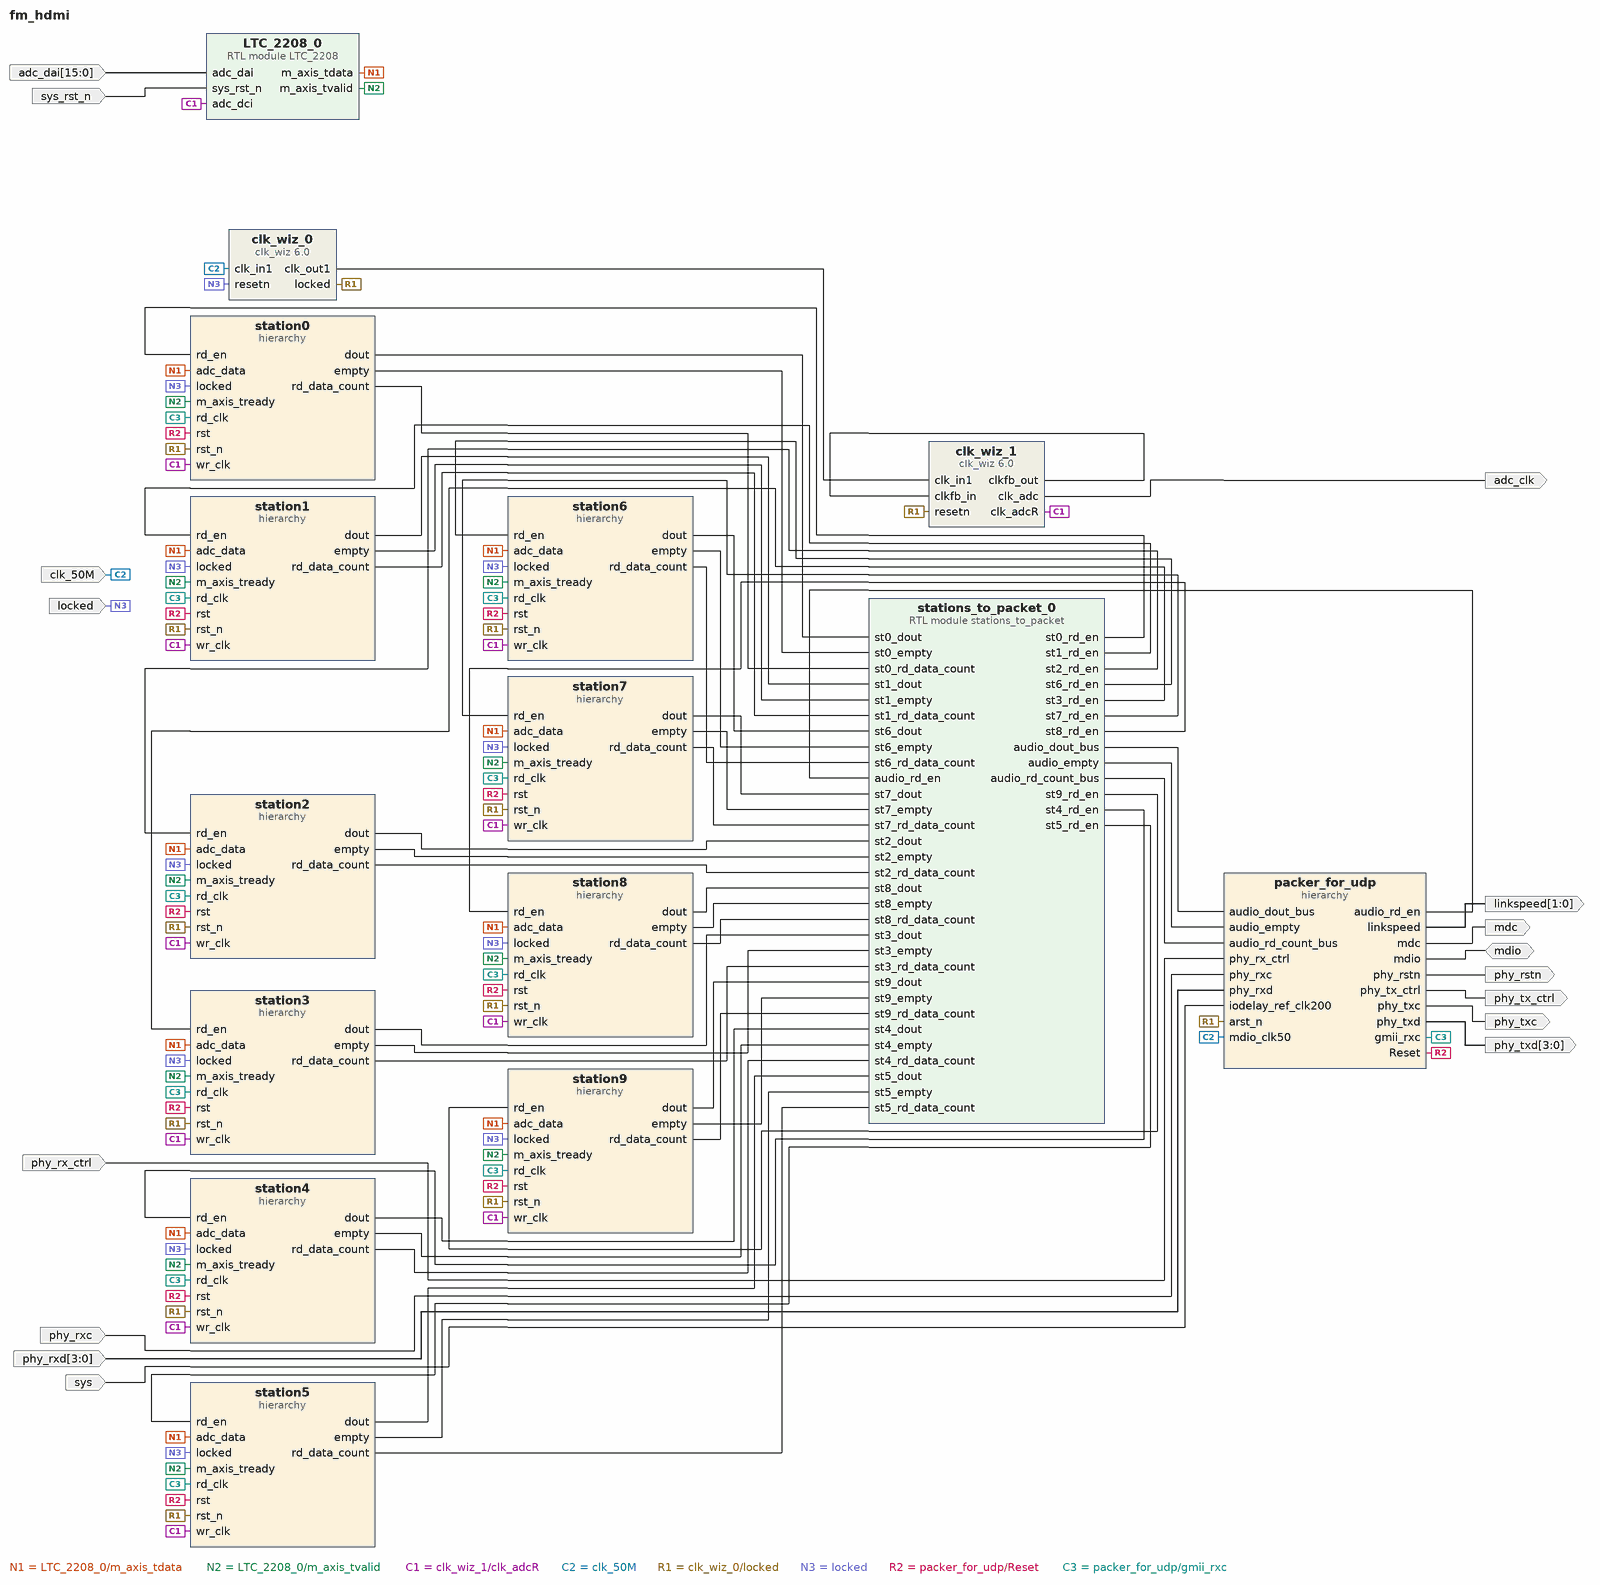
[diagram p0: block diagram of the top level]
# Vivado block design fm_hdmi, xc7z020clg400-2, Vivado 2023.2
create_bd_design fm_hdmi

create_bd_port -dir I -type rst sys_rst_n
create_bd_port -dir I -from 15 -to 0 adc_dai
create_bd_port -dir I locked
create_bd_port -dir I -type clk sys
set_property -dict {CONFIG.FREQ_HZ 200000000} [get_bd_ports sys]
create_bd_port -dir I -type clk clk_50M
set_property -dict {CONFIG.FREQ_HZ 50000000} [get_bd_ports clk_50M]
create_bd_port -dir O -type clk adc_clk
create_bd_port -dir I phy_rxc
create_bd_port -dir I phy_rx_ctrl
create_bd_port -dir I -from 3 -to 0 phy_rxd
create_bd_port -dir IO mdio
create_bd_port -dir O -from 3 -to 0 phy_txd
create_bd_port -dir O mdc
create_bd_port -dir O -type rst phy_rstn
create_bd_port -dir O phy_tx_ctrl
create_bd_port -dir O -from 1 -to 0 linkspeed
create_bd_port -dir O phy_txc

create_bd_cell -type ip -vlnv xilinx.com:ip:clk_wiz:6.0 clk_wiz_0
set_property -dict [list \
  CONFIG.CLKIN1_JITTER_PS 200.0 \
  CONFIG.CLKOUT1_DRIVES BUFG \
  CONFIG.CLKOUT1_JITTER 114.306 \
  CONFIG.CLKOUT1_PHASE_ERROR 120.359 \
  CONFIG.CLKOUT1_REQUESTED_OUT_FREQ 64 \
  CONFIG.CLKOUT2_DRIVES BUFG \
  CONFIG.CLKOUT3_DRIVES BUFG \
  CONFIG.CLKOUT4_DRIVES BUFG \
  CONFIG.CLKOUT5_DRIVES BUFG \
  CONFIG.CLKOUT6_DRIVES BUFG \
  CONFIG.CLKOUT7_DRIVES BUFG \
  CONFIG.MMCM_BANDWIDTH OPTIMIZED \
  CONFIG.MMCM_CLKFBOUT_MULT_F 32 \
  CONFIG.MMCM_CLKIN1_PERIOD 20.000 \
  CONFIG.MMCM_CLKIN2_PERIOD 10.0 \
  CONFIG.MMCM_CLKOUT0_DIVIDE_F 25 \
  CONFIG.MMCM_COMPENSATION ZHOLD \
  CONFIG.PRIMITIVE PLL \
  CONFIG.PRIM_IN_FREQ 50 \
  CONFIG.PRIM_SOURCE No_buffer \
  CONFIG.RESET_PORT resetn \
  CONFIG.RESET_TYPE ACTIVE_LOW \
] [get_bd_cells clk_wiz_0]
create_bd_cell -type ip -vlnv xilinx.com:ip:clk_wiz:6.0 clk_wiz_1
set_property -dict [list \
  CONFIG.CLKIN1_JITTER_PS 156.25 \
  CONFIG.CLKOUT1_DRIVES No_buffer \
  CONFIG.CLKOUT1_JITTER 107.365 \
  CONFIG.CLKOUT1_PHASE_ERROR 119.507 \
  CONFIG.CLKOUT1_REQUESTED_OUT_FREQ 76.8 \
  CONFIG.CLKOUT2_DRIVES BUFG \
  CONFIG.CLKOUT2_JITTER 107.365 \
  CONFIG.CLKOUT2_PHASE_ERROR 119.507 \
  CONFIG.CLKOUT2_REQUESTED_OUT_FREQ 76.8 \
  CONFIG.CLKOUT2_REQUESTED_PHASE 65 \
  CONFIG.CLKOUT2_USED true \
  CONFIG.CLKOUT3_DRIVES BUFG \
  CONFIG.CLKOUT4_DRIVES BUFG \
  CONFIG.CLKOUT5_DRIVES BUFG \
  CONFIG.CLKOUT6_DRIVES BUFG \
  CONFIG.CLKOUT7_DRIVES BUFG \
  CONFIG.CLK_OUT1_PORT clk_adc \
  CONFIG.CLK_OUT2_PORT clk_adcR \
  CONFIG.FEEDBACK_SOURCE FDBK_ONCHIP \
  CONFIG.JITTER_SEL Min_O_Jitter \
  CONFIG.MMCM_BANDWIDTH HIGH \
  CONFIG.MMCM_CLKFBOUT_MULT_F 24 \
  CONFIG.MMCM_CLKIN1_PERIOD 15.625 \
  CONFIG.MMCM_CLKIN2_PERIOD 10.0 \
  CONFIG.MMCM_CLKOUT0_DIVIDE_F 20 \
  CONFIG.MMCM_CLKOUT1_DIVIDE 20 \
  CONFIG.MMCM_CLKOUT1_PHASE 65.250 \
  CONFIG.MMCM_COMPENSATION ZHOLD \
  CONFIG.MMCM_DIVCLK_DIVIDE 1 \
  CONFIG.NUM_OUT_CLKS 2 \
  CONFIG.PLL_CLKIN_PERIOD 15.625 \
  CONFIG.PRIMITIVE PLL \
  CONFIG.PRIM_IN_FREQ 64 \
  CONFIG.PRIM_SOURCE No_buffer \
  CONFIG.RESET_PORT resetn \
  CONFIG.RESET_TYPE ACTIVE_LOW \
] [get_bd_cells clk_wiz_1]
create_bd_cell -type hier packer_for_udp
create_bd_cell -type module -reference LTC_2208 LTC_2208_0
create_bd_cell -type hier station0
create_bd_cell -type module -reference stations_to_packet stations_to_packet_0
set_property -dict {CONFIG.COUNT_W 7 CONFIG.STATIONS 10} [get_bd_cells stations_to_packet_0]
create_bd_cell -type hier station1
create_bd_cell -type hier station2
create_bd_cell -type hier station3
create_bd_cell -type hier station4
create_bd_cell -type hier station5
create_bd_cell -type hier station6
create_bd_cell -type hier station7
create_bd_cell -type hier station8
create_bd_cell -type hier station9

# ---- hierarchy /packer_for_udp ----
current_bd_instance /packer_for_udp
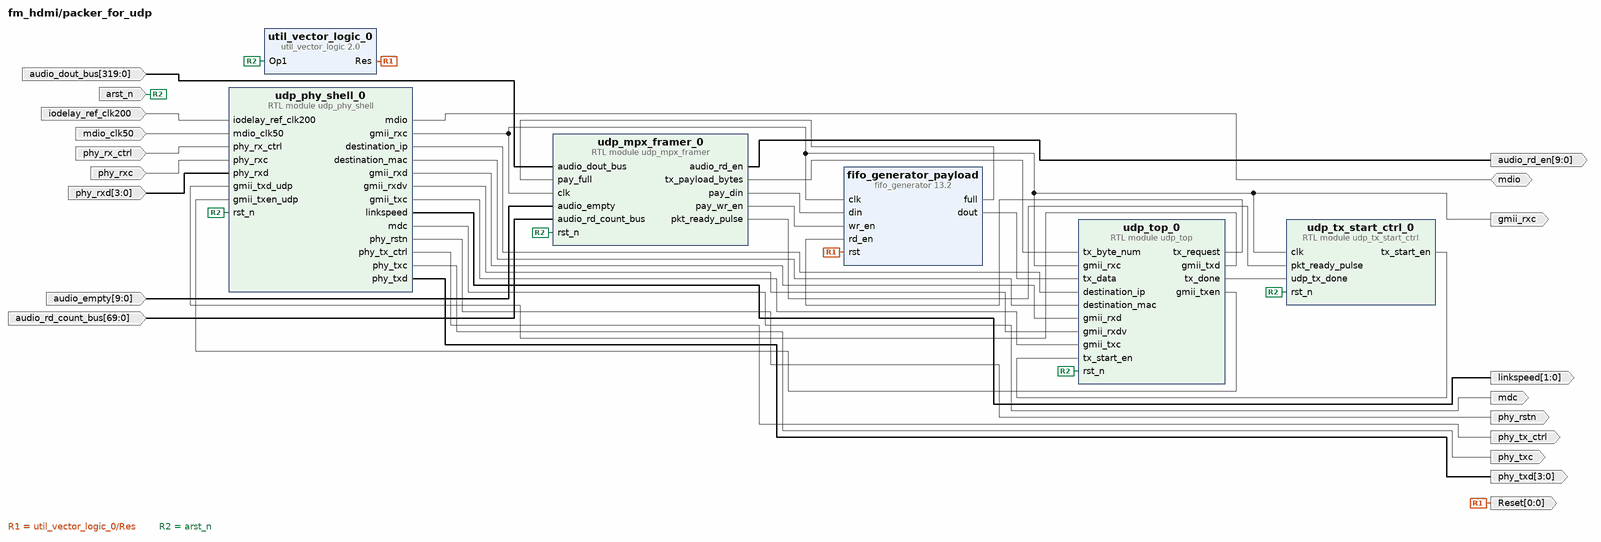
[diagram p1: block diagram inside /packer_for_udp]
create_bd_pin -dir I -type rst arst_n
create_bd_pin -dir I iodelay_ref_clk200
create_bd_pin -dir I mdio_clk50
create_bd_pin -dir I phy_rx_ctrl
create_bd_pin -dir I -from 3 -to 0 phy_rxd
create_bd_pin -dir I phy_rxc
create_bd_pin -dir O -from 3 -to 0 phy_txd
create_bd_pin -dir O mdc
create_bd_pin -dir IO mdio
create_bd_pin -dir O -from 1 -to 0 linkspeed
create_bd_pin -dir O phy_txc
create_bd_pin -dir O phy_tx_ctrl
create_bd_pin -dir O -type rst phy_rstn
create_bd_pin -dir O gmii_rxc
create_bd_pin -dir O -from 0 -to 0 Reset
create_bd_pin -dir O -from 9 -to 0 audio_rd_en
create_bd_pin -dir I -from 9 -to 0 audio_empty
create_bd_pin -dir I -from 319 -to 0 audio_dout_bus
create_bd_pin -dir I -from 69 -to 0 audio_rd_count_bus

create_bd_cell -type module -reference udp_mpx_framer udp_mpx_framer_0
set_property -dict {CONFIG.AUDIO_COUNT_WIDTH 7 CONFIG.N_STATIONS 10 CONFIG.TARGET_DELAY_US 350} [get_bd_cells udp_mpx_framer_0]
create_bd_cell -type ip -vlnv xilinx.com:ip:fifo_generator:13.2 fifo_generator_payload
set_property -dict [list \
  CONFIG.Data_Count true \
  CONFIG.Enable_Safety_Circuit true \
  CONFIG.Input_Data_Width 32 \
  CONFIG.Input_Depth 512 \
  CONFIG.Performance_Options Standard_FIFO \
  CONFIG.Reset_Type Asynchronous_Reset \
] [get_bd_cells fifo_generator_payload]
create_bd_cell -type module -reference udp_phy_shell udp_phy_shell_0
create_bd_cell -type module -reference udp_tx_start_ctrl udp_tx_start_ctrl_0
create_bd_cell -type ip -vlnv xilinx.com:ip:util_vector_logic:2.0 util_vector_logic_0
set_property -dict {CONFIG.C_OPERATION not CONFIG.C_SIZE 1} [get_bd_cells util_vector_logic_0]
create_bd_cell -type module -reference udp_top udp_top_0

# ---- hierarchy /station0 ----
current_bd_instance /station0
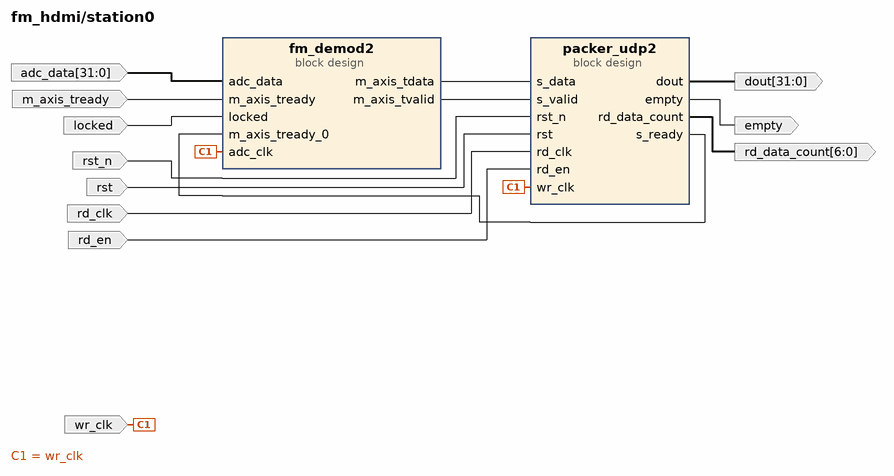
[diagram p2: block diagram inside /station0]
create_bd_pin -dir I -type clk wr_clk
create_bd_pin -dir I -from 31 -to 0 adc_data
create_bd_pin -dir I locked
create_bd_pin -dir I m_axis_tready
create_bd_pin -dir I -type clk rd_clk
create_bd_pin -dir I rst
create_bd_pin -dir I -type rst rst_n
create_bd_pin -dir I rd_en
create_bd_pin -dir O empty
create_bd_pin -dir O -from 6 -to 0 rd_data_count
create_bd_pin -dir O -from 31 -to 0 dout

create_bd_cell -type container -reference fm_demod2 fm_demod2
set_property -dict [list \
  CONFIG.ACTIVE_SIM_BD fm_demod2.bd \
  CONFIG.ACTIVE_SYNTH_BD fm_demod2.bd \
  CONFIG.ENABLE_DFX 0 \
  CONFIG.LIST_SIM_BD fm_demod2.bd \
  CONFIG.LIST_SYNTH_BD fm_demod2.bd \
  CONFIG.LOCK_PROPAGATE 0 \
] [get_bd_cells fm_demod2]
create_bd_cell -type container -reference packer_udp2 packer_udp2
set_property -dict [list \
  CONFIG.ACTIVE_SIM_BD packer_udp2.bd \
  CONFIG.ACTIVE_SYNTH_BD packer_udp2.bd \
  CONFIG.ENABLE_DFX 0 \
  CONFIG.LIST_SIM_BD packer_udp2.bd \
  CONFIG.LIST_SYNTH_BD packer_udp2.bd \
  CONFIG.LOCK_PROPAGATE 0 \
] [get_bd_cells packer_udp2]

# ---- hierarchy /station1 ----
current_bd_instance /station1
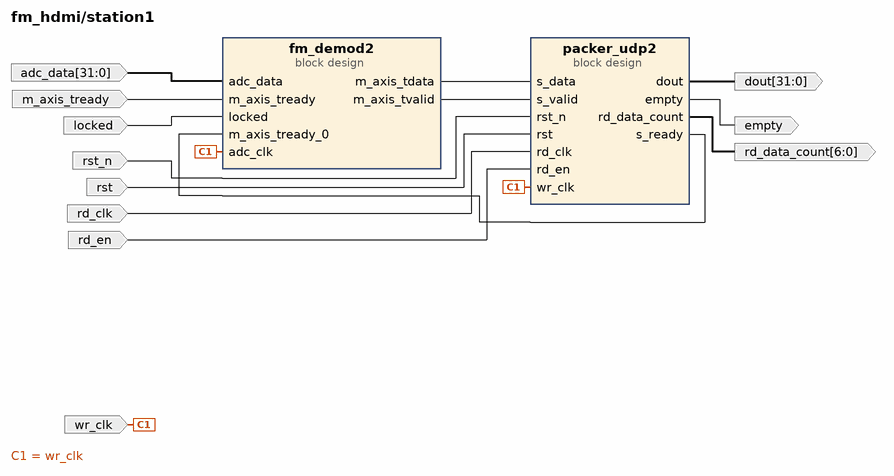
[diagram p3: block diagram inside /station1]
create_bd_pin -dir I -type clk wr_clk
create_bd_pin -dir I -from 31 -to 0 adc_data
create_bd_pin -dir I locked
create_bd_pin -dir I m_axis_tready
create_bd_pin -dir I -type clk rd_clk
create_bd_pin -dir I rst
create_bd_pin -dir I -type rst rst_n
create_bd_pin -dir I rd_en
create_bd_pin -dir O empty
create_bd_pin -dir O -from 6 -to 0 rd_data_count
create_bd_pin -dir O -from 31 -to 0 dout

create_bd_cell -type container -reference fm_demod2 fm_demod2
set_property -dict [list \
  CONFIG.ACTIVE_SIM_BD fm_demod2.bd \
  CONFIG.ACTIVE_SYNTH_BD fm_demod2.bd \
  CONFIG.ENABLE_DFX 0 \
  CONFIG.LIST_SIM_BD fm_demod2.bd \
  CONFIG.LIST_SYNTH_BD fm_demod2.bd \
  CONFIG.LOCK_PROPAGATE 0 \
] [get_bd_cells fm_demod2]
create_bd_cell -type container -reference packer_udp2 packer_udp2
set_property -dict [list \
  CONFIG.ACTIVE_SIM_BD packer_udp2.bd \
  CONFIG.ACTIVE_SYNTH_BD packer_udp2.bd \
  CONFIG.ENABLE_DFX 0 \
  CONFIG.LIST_SIM_BD packer_udp2.bd \
  CONFIG.LIST_SYNTH_BD packer_udp2.bd \
  CONFIG.LOCK_PROPAGATE 0 \
] [get_bd_cells packer_udp2]

# ---- hierarchy /station2 ----
current_bd_instance /station2
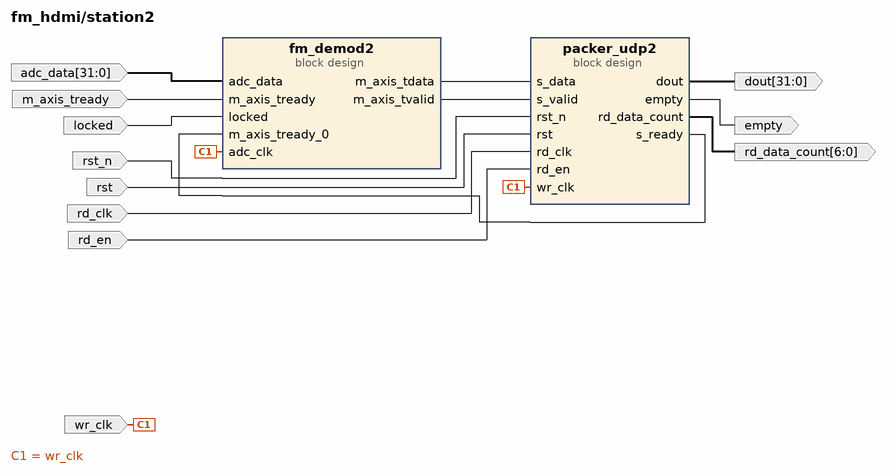
[diagram p4: block diagram inside /station2]
create_bd_pin -dir I -type clk wr_clk
create_bd_pin -dir I -from 31 -to 0 adc_data
create_bd_pin -dir I locked
create_bd_pin -dir I m_axis_tready
create_bd_pin -dir I -type clk rd_clk
create_bd_pin -dir I rst
create_bd_pin -dir I -type rst rst_n
create_bd_pin -dir I rd_en
create_bd_pin -dir O empty
create_bd_pin -dir O -from 6 -to 0 rd_data_count
create_bd_pin -dir O -from 31 -to 0 dout

create_bd_cell -type container -reference fm_demod2 fm_demod2
set_property -dict [list \
  CONFIG.ACTIVE_SIM_BD fm_demod2.bd \
  CONFIG.ACTIVE_SYNTH_BD fm_demod2.bd \
  CONFIG.ENABLE_DFX 0 \
  CONFIG.LIST_SIM_BD fm_demod2.bd \
  CONFIG.LIST_SYNTH_BD fm_demod2.bd \
  CONFIG.LOCK_PROPAGATE 0 \
] [get_bd_cells fm_demod2]
create_bd_cell -type container -reference packer_udp2 packer_udp2
set_property -dict [list \
  CONFIG.ACTIVE_SIM_BD packer_udp2.bd \
  CONFIG.ACTIVE_SYNTH_BD packer_udp2.bd \
  CONFIG.ENABLE_DFX 0 \
  CONFIG.LIST_SIM_BD packer_udp2.bd \
  CONFIG.LIST_SYNTH_BD packer_udp2.bd \
  CONFIG.LOCK_PROPAGATE 0 \
] [get_bd_cells packer_udp2]

# ---- hierarchy /station3 ----
current_bd_instance /station3
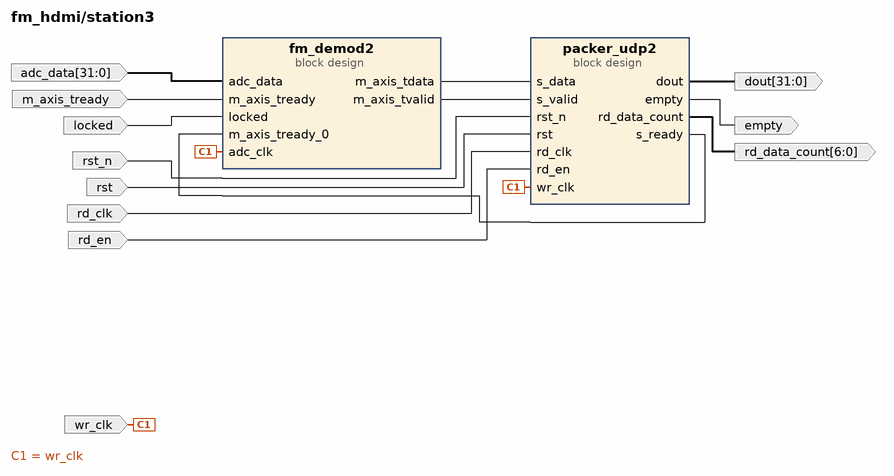
[diagram p5: block diagram inside /station3]
create_bd_pin -dir I -type clk wr_clk
create_bd_pin -dir I -from 31 -to 0 adc_data
create_bd_pin -dir I locked
create_bd_pin -dir I m_axis_tready
create_bd_pin -dir I -type clk rd_clk
create_bd_pin -dir I rst
create_bd_pin -dir I -type rst rst_n
create_bd_pin -dir I rd_en
create_bd_pin -dir O empty
create_bd_pin -dir O -from 6 -to 0 rd_data_count
create_bd_pin -dir O -from 31 -to 0 dout

create_bd_cell -type container -reference fm_demod2 fm_demod2
set_property -dict [list \
  CONFIG.ACTIVE_SIM_BD fm_demod2.bd \
  CONFIG.ACTIVE_SYNTH_BD fm_demod2.bd \
  CONFIG.ENABLE_DFX 0 \
  CONFIG.LIST_SIM_BD fm_demod2.bd \
  CONFIG.LIST_SYNTH_BD fm_demod2.bd \
  CONFIG.LOCK_PROPAGATE 0 \
] [get_bd_cells fm_demod2]
create_bd_cell -type container -reference packer_udp2 packer_udp2
set_property -dict [list \
  CONFIG.ACTIVE_SIM_BD packer_udp2.bd \
  CONFIG.ACTIVE_SYNTH_BD packer_udp2.bd \
  CONFIG.ENABLE_DFX 0 \
  CONFIG.LIST_SIM_BD packer_udp2.bd \
  CONFIG.LIST_SYNTH_BD packer_udp2.bd \
  CONFIG.LOCK_PROPAGATE 0 \
] [get_bd_cells packer_udp2]

# ---- hierarchy /station4 ----
current_bd_instance /station4
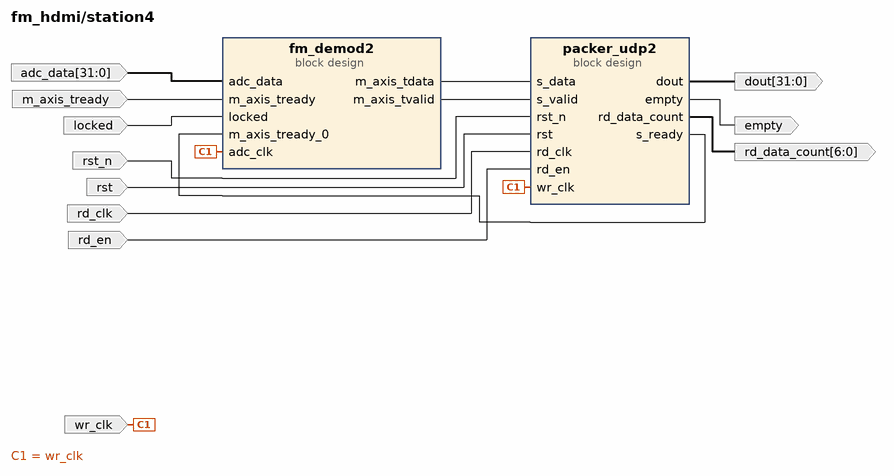
[diagram p6: block diagram inside /station4]
create_bd_pin -dir I -type clk wr_clk
create_bd_pin -dir I -from 31 -to 0 adc_data
create_bd_pin -dir I locked
create_bd_pin -dir I m_axis_tready
create_bd_pin -dir I -type clk rd_clk
create_bd_pin -dir I rst
create_bd_pin -dir I -type rst rst_n
create_bd_pin -dir I rd_en
create_bd_pin -dir O empty
create_bd_pin -dir O -from 6 -to 0 rd_data_count
create_bd_pin -dir O -from 31 -to 0 dout

create_bd_cell -type container -reference fm_demod2 fm_demod2
set_property -dict [list \
  CONFIG.ACTIVE_SIM_BD fm_demod2.bd \
  CONFIG.ACTIVE_SYNTH_BD fm_demod2.bd \
  CONFIG.ENABLE_DFX 0 \
  CONFIG.LIST_SIM_BD fm_demod2.bd \
  CONFIG.LIST_SYNTH_BD fm_demod2.bd \
  CONFIG.LOCK_PROPAGATE 0 \
] [get_bd_cells fm_demod2]
create_bd_cell -type container -reference packer_udp2 packer_udp2
set_property -dict [list \
  CONFIG.ACTIVE_SIM_BD packer_udp2.bd \
  CONFIG.ACTIVE_SYNTH_BD packer_udp2.bd \
  CONFIG.ENABLE_DFX 0 \
  CONFIG.LIST_SIM_BD packer_udp2.bd \
  CONFIG.LIST_SYNTH_BD packer_udp2.bd \
  CONFIG.LOCK_PROPAGATE 0 \
] [get_bd_cells packer_udp2]

# ---- hierarchy /station5 ----
current_bd_instance /station5
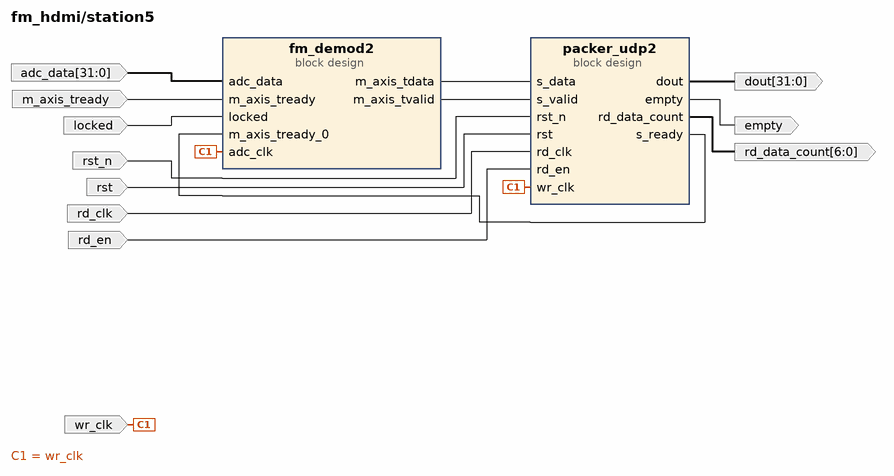
[diagram p7: block diagram inside /station5]
create_bd_pin -dir I -type clk wr_clk
create_bd_pin -dir I -from 31 -to 0 adc_data
create_bd_pin -dir I locked
create_bd_pin -dir I m_axis_tready
create_bd_pin -dir I -type clk rd_clk
create_bd_pin -dir I rst
create_bd_pin -dir I -type rst rst_n
create_bd_pin -dir I rd_en
create_bd_pin -dir O empty
create_bd_pin -dir O -from 6 -to 0 rd_data_count
create_bd_pin -dir O -from 31 -to 0 dout

create_bd_cell -type container -reference fm_demod2 fm_demod2
set_property -dict [list \
  CONFIG.ACTIVE_SIM_BD fm_demod2.bd \
  CONFIG.ACTIVE_SYNTH_BD fm_demod2.bd \
  CONFIG.ENABLE_DFX 0 \
  CONFIG.LIST_SIM_BD fm_demod2.bd \
  CONFIG.LIST_SYNTH_BD fm_demod2.bd \
  CONFIG.LOCK_PROPAGATE 0 \
] [get_bd_cells fm_demod2]
create_bd_cell -type container -reference packer_udp2 packer_udp2
set_property -dict [list \
  CONFIG.ACTIVE_SIM_BD packer_udp2.bd \
  CONFIG.ACTIVE_SYNTH_BD packer_udp2.bd \
  CONFIG.ENABLE_DFX 0 \
  CONFIG.LIST_SIM_BD packer_udp2.bd \
  CONFIG.LIST_SYNTH_BD packer_udp2.bd \
  CONFIG.LOCK_PROPAGATE 0 \
] [get_bd_cells packer_udp2]

# ---- hierarchy /station6 ----
current_bd_instance /station6
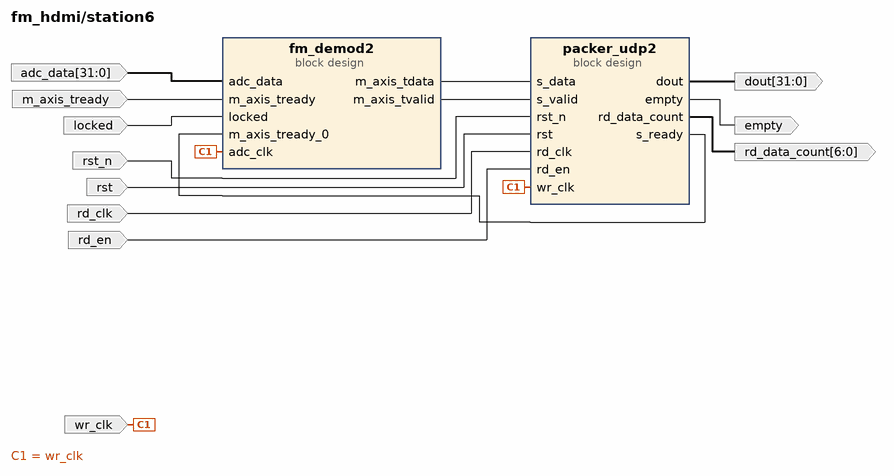
[diagram p8: block diagram inside /station6]
create_bd_pin -dir I -type clk wr_clk
create_bd_pin -dir I -from 31 -to 0 adc_data
create_bd_pin -dir I locked
create_bd_pin -dir I m_axis_tready
create_bd_pin -dir I -type clk rd_clk
create_bd_pin -dir I rst
create_bd_pin -dir I -type rst rst_n
create_bd_pin -dir I rd_en
create_bd_pin -dir O empty
create_bd_pin -dir O -from 6 -to 0 rd_data_count
create_bd_pin -dir O -from 31 -to 0 dout

create_bd_cell -type container -reference fm_demod2 fm_demod2
set_property -dict [list \
  CONFIG.ACTIVE_SIM_BD fm_demod2.bd \
  CONFIG.ACTIVE_SYNTH_BD fm_demod2.bd \
  CONFIG.ENABLE_DFX 0 \
  CONFIG.LIST_SIM_BD fm_demod2.bd \
  CONFIG.LIST_SYNTH_BD fm_demod2.bd \
  CONFIG.LOCK_PROPAGATE 0 \
] [get_bd_cells fm_demod2]
create_bd_cell -type container -reference packer_udp2 packer_udp2
set_property -dict [list \
  CONFIG.ACTIVE_SIM_BD packer_udp2.bd \
  CONFIG.ACTIVE_SYNTH_BD packer_udp2.bd \
  CONFIG.ENABLE_DFX 0 \
  CONFIG.LIST_SIM_BD packer_udp2.bd \
  CONFIG.LIST_SYNTH_BD packer_udp2.bd \
  CONFIG.LOCK_PROPAGATE 0 \
] [get_bd_cells packer_udp2]

# ---- hierarchy /station7 ----
current_bd_instance /station7
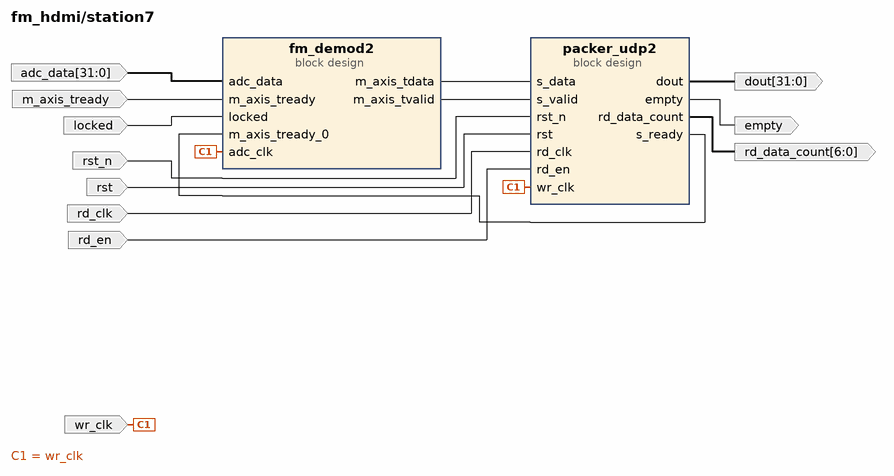
[diagram p9: block diagram inside /station7]
create_bd_pin -dir I -type clk wr_clk
create_bd_pin -dir I -from 31 -to 0 adc_data
create_bd_pin -dir I locked
create_bd_pin -dir I m_axis_tready
create_bd_pin -dir I -type clk rd_clk
create_bd_pin -dir I rst
create_bd_pin -dir I -type rst rst_n
create_bd_pin -dir I rd_en
create_bd_pin -dir O empty
create_bd_pin -dir O -from 6 -to 0 rd_data_count
create_bd_pin -dir O -from 31 -to 0 dout

create_bd_cell -type container -reference fm_demod2 fm_demod2
set_property -dict [list \
  CONFIG.ACTIVE_SIM_BD fm_demod2.bd \
  CONFIG.ACTIVE_SYNTH_BD fm_demod2.bd \
  CONFIG.ENABLE_DFX 0 \
  CONFIG.LIST_SIM_BD fm_demod2.bd \
  CONFIG.LIST_SYNTH_BD fm_demod2.bd \
  CONFIG.LOCK_PROPAGATE 0 \
] [get_bd_cells fm_demod2]
create_bd_cell -type container -reference packer_udp2 packer_udp2
set_property -dict [list \
  CONFIG.ACTIVE_SIM_BD packer_udp2.bd \
  CONFIG.ACTIVE_SYNTH_BD packer_udp2.bd \
  CONFIG.ENABLE_DFX 0 \
  CONFIG.LIST_SIM_BD packer_udp2.bd \
  CONFIG.LIST_SYNTH_BD packer_udp2.bd \
  CONFIG.LOCK_PROPAGATE 0 \
] [get_bd_cells packer_udp2]

# ---- hierarchy /station8 ----
current_bd_instance /station8
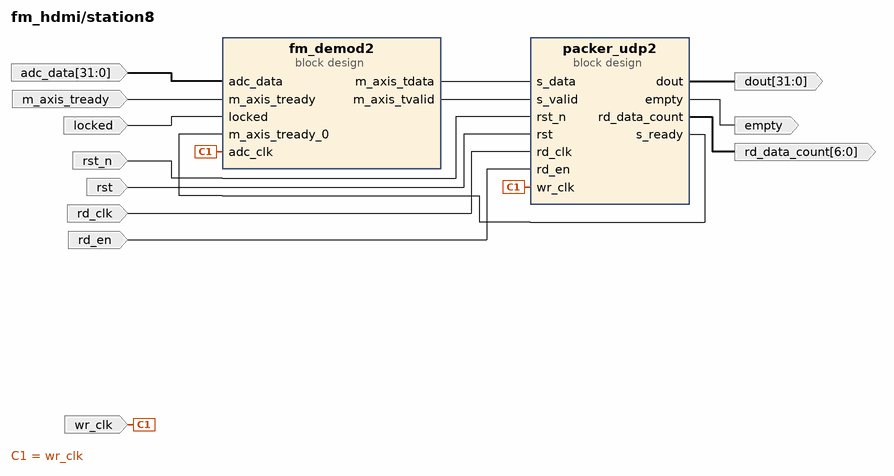
[diagram p10: block diagram inside /station8]
create_bd_pin -dir I -type clk wr_clk
create_bd_pin -dir I -from 31 -to 0 adc_data
create_bd_pin -dir I locked
create_bd_pin -dir I m_axis_tready
create_bd_pin -dir I -type clk rd_clk
create_bd_pin -dir I rst
create_bd_pin -dir I -type rst rst_n
create_bd_pin -dir I rd_en
create_bd_pin -dir O empty
create_bd_pin -dir O -from 6 -to 0 rd_data_count
create_bd_pin -dir O -from 31 -to 0 dout

create_bd_cell -type container -reference fm_demod2 fm_demod2
set_property -dict [list \
  CONFIG.ACTIVE_SIM_BD fm_demod2.bd \
  CONFIG.ACTIVE_SYNTH_BD fm_demod2.bd \
  CONFIG.ENABLE_DFX 0 \
  CONFIG.LIST_SIM_BD fm_demod2.bd \
  CONFIG.LIST_SYNTH_BD fm_demod2.bd \
  CONFIG.LOCK_PROPAGATE 0 \
] [get_bd_cells fm_demod2]
create_bd_cell -type container -reference packer_udp2 packer_udp2
set_property -dict [list \
  CONFIG.ACTIVE_SIM_BD packer_udp2.bd \
  CONFIG.ACTIVE_SYNTH_BD packer_udp2.bd \
  CONFIG.ENABLE_DFX 0 \
  CONFIG.LIST_SIM_BD packer_udp2.bd \
  CONFIG.LIST_SYNTH_BD packer_udp2.bd \
  CONFIG.LOCK_PROPAGATE 0 \
] [get_bd_cells packer_udp2]

# ---- hierarchy /station9 ----
current_bd_instance /station9
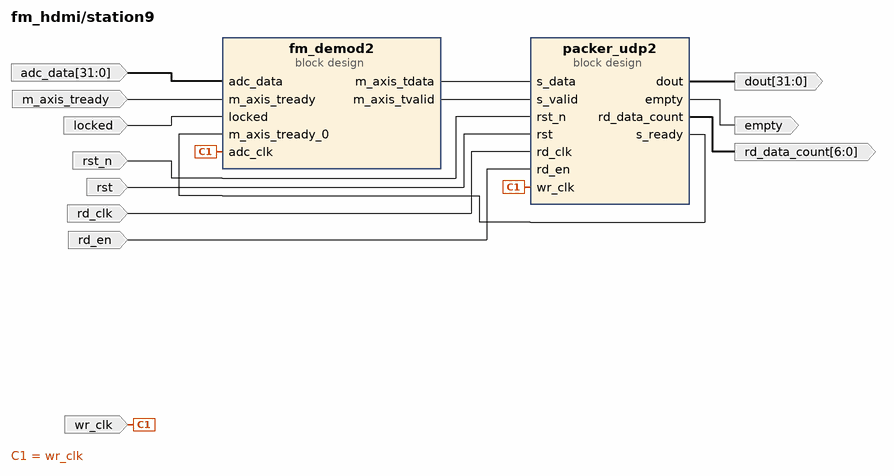
[diagram p11: block diagram inside /station9]
create_bd_pin -dir I -type clk wr_clk
create_bd_pin -dir I -from 31 -to 0 adc_data
create_bd_pin -dir I locked
create_bd_pin -dir I m_axis_tready
create_bd_pin -dir I -type clk rd_clk
create_bd_pin -dir I rst
create_bd_pin -dir I -type rst rst_n
create_bd_pin -dir I rd_en
create_bd_pin -dir O empty
create_bd_pin -dir O -from 6 -to 0 rd_data_count
create_bd_pin -dir O -from 31 -to 0 dout

create_bd_cell -type container -reference fm_demod2 fm_demod2
set_property -dict [list \
  CONFIG.ACTIVE_SIM_BD fm_demod2.bd \
  CONFIG.ACTIVE_SYNTH_BD fm_demod2.bd \
  CONFIG.ENABLE_DFX 0 \
  CONFIG.LIST_SIM_BD fm_demod2.bd \
  CONFIG.LIST_SYNTH_BD fm_demod2.bd \
  CONFIG.LOCK_PROPAGATE 0 \
] [get_bd_cells fm_demod2]
create_bd_cell -type container -reference packer_udp2 packer_udp2
set_property -dict [list \
  CONFIG.ACTIVE_SIM_BD packer_udp2.bd \
  CONFIG.ACTIVE_SYNTH_BD packer_udp2.bd \
  CONFIG.ENABLE_DFX 0 \
  CONFIG.LIST_SIM_BD packer_udp2.bd \
  CONFIG.LIST_SYNTH_BD packer_udp2.bd \
  CONFIG.LOCK_PROPAGATE 0 \
] [get_bd_cells packer_udp2]

# ---- connections ----

current_bd_instance /packer_for_udp
connect_bd_net [get_bd_pins util_vector_logic_0/Res] [get_bd_pins fifo_generator_payload/rst] [get_bd_pins Reset]
connect_bd_net [get_bd_pins mdio] [get_bd_pins udp_phy_shell_0/mdio]
connect_bd_net -net audio_dout_bus_0_1 [get_bd_pins audio_dout_bus] [get_bd_pins udp_mpx_framer_0/audio_dout_bus]
connect_bd_net -net audio_empty_0_1 [get_bd_pins audio_empty] [get_bd_pins udp_mpx_framer_0/audio_empty]
connect_bd_net -net audio_rd_count_bus_0_1 [get_bd_pins audio_rd_count_bus] [get_bd_pins udp_mpx_framer_0/audio_rd_count_bus]
connect_bd_net [get_bd_pins fifo_generator_payload/dout] [get_bd_pins udp_top_0/tx_data]
connect_bd_net [get_bd_pins fifo_generator_payload/full] [get_bd_pins udp_mpx_framer_0/pay_full]
connect_bd_net -net iodelay_ref_clk200_0_1 [get_bd_pins iodelay_ref_clk200] [get_bd_pins udp_phy_shell_0/iodelay_ref_clk200]
connect_bd_net -net mdio_clk50_0_1 [get_bd_pins mdio_clk50] [get_bd_pins udp_phy_shell_0/mdio_clk50]
connect_bd_net -net phy_rx_ctrl_0_1 [get_bd_pins phy_rx_ctrl] [get_bd_pins udp_phy_shell_0/phy_rx_ctrl]
connect_bd_net -net phy_rxc_0_1 [get_bd_pins phy_rxc] [get_bd_pins udp_phy_shell_0/phy_rxc]
connect_bd_net -net phy_rxd_0_1 [get_bd_pins phy_rxd] [get_bd_pins udp_phy_shell_0/phy_rxd]
connect_bd_net -net rst_n_0_1 [get_bd_pins arst_n] \
  [get_bd_pins util_vector_logic_0/Op1] [get_bd_pins udp_phy_shell_0/rst_n] [get_bd_pins udp_top_0/rst_n] \
  [get_bd_pins udp_tx_start_ctrl_0/rst_n] [get_bd_pins udp_mpx_framer_0/rst_n]
connect_bd_net [get_bd_pins udp_mpx_framer_0/audio_rd_en] [get_bd_pins audio_rd_en]
connect_bd_net [get_bd_pins udp_mpx_framer_0/pay_din] [get_bd_pins fifo_generator_payload/din]
connect_bd_net [get_bd_pins udp_mpx_framer_0/pay_wr_en] [get_bd_pins fifo_generator_payload/wr_en]
connect_bd_net [get_bd_pins udp_mpx_framer_0/pkt_ready_pulse] [get_bd_pins udp_tx_start_ctrl_0/pkt_ready_pulse]
connect_bd_net [get_bd_pins udp_mpx_framer_0/tx_payload_bytes] [get_bd_pins udp_top_0/tx_byte_num]
connect_bd_net [get_bd_pins udp_phy_shell_0/destination_ip] [get_bd_pins udp_top_0/destination_ip]
connect_bd_net [get_bd_pins udp_phy_shell_0/destination_mac] [get_bd_pins udp_top_0/destination_mac]
connect_bd_net [get_bd_pins udp_phy_shell_0/gmii_rxc] \
  [get_bd_pins fifo_generator_payload/clk] [get_bd_pins udp_top_0/gmii_rxc] [get_bd_pins udp_tx_start_ctrl_0/clk] \
  [get_bd_pins udp_mpx_framer_0/clk] [get_bd_pins gmii_rxc]
connect_bd_net [get_bd_pins udp_phy_shell_0/gmii_rxd] [get_bd_pins udp_top_0/gmii_rxd]
connect_bd_net [get_bd_pins udp_phy_shell_0/gmii_rxdv] [get_bd_pins udp_top_0/gmii_rxdv]
connect_bd_net [get_bd_pins udp_phy_shell_0/gmii_txc] [get_bd_pins udp_top_0/gmii_txc]
connect_bd_net [get_bd_pins udp_phy_shell_0/linkspeed] [get_bd_pins linkspeed]
connect_bd_net [get_bd_pins udp_phy_shell_0/mdc] [get_bd_pins mdc]
connect_bd_net [get_bd_pins udp_phy_shell_0/phy_rstn] [get_bd_pins phy_rstn]
connect_bd_net [get_bd_pins udp_phy_shell_0/phy_tx_ctrl] [get_bd_pins phy_tx_ctrl]
connect_bd_net [get_bd_pins udp_phy_shell_0/phy_txc] [get_bd_pins phy_txc]
connect_bd_net [get_bd_pins udp_phy_shell_0/phy_txd] [get_bd_pins phy_txd]
connect_bd_net [get_bd_pins udp_top_0/gmii_txd] [get_bd_pins udp_phy_shell_0/gmii_txd_udp]
connect_bd_net [get_bd_pins udp_top_0/gmii_txen] [get_bd_pins udp_phy_shell_0/gmii_txen_udp]
connect_bd_net [get_bd_pins udp_top_0/tx_done] [get_bd_pins udp_tx_start_ctrl_0/udp_tx_done]
connect_bd_net [get_bd_pins udp_top_0/tx_request] [get_bd_pins fifo_generator_payload/rd_en]
connect_bd_net [get_bd_pins udp_tx_start_ctrl_0/tx_start_en] [get_bd_pins udp_top_0/tx_start_en]

current_bd_instance /station0
connect_bd_net -net LTC_2208_0_m_axis_tdata [get_bd_pins adc_data] [get_bd_pins fm_demod2/adc_data]
connect_bd_net -net LTC_2208_0_m_axis_tvalid [get_bd_pins m_axis_tready] [get_bd_pins fm_demod2/m_axis_tready]
connect_bd_net -net adc_dci_0_1 [get_bd_pins wr_clk] [get_bd_pins packer_udp2/wr_clk] [get_bd_pins fm_demod2/adc_clk]
connect_bd_net -net clk_wiz_0_locked [get_bd_pins rst_n] [get_bd_pins packer_udp2/rst_n]
connect_bd_net -net en_0_1 [get_bd_pins locked] [get_bd_pins fm_demod2/locked]
connect_bd_net [get_bd_pins fm_demod2/m_axis_tdata] [get_bd_pins packer_udp2/s_data]
connect_bd_net [get_bd_pins fm_demod2/m_axis_tvalid] [get_bd_pins packer_udp2/s_valid]
connect_bd_net -net packer_for_udp_Res1 [get_bd_pins rst] [get_bd_pins packer_udp2/rst]
connect_bd_net -net packer_for_udp_gmii_rxc [get_bd_pins rd_clk] [get_bd_pins packer_udp2/rd_clk]
connect_bd_net [get_bd_pins packer_udp2/dout] [get_bd_pins dout]
connect_bd_net [get_bd_pins packer_udp2/empty] [get_bd_pins empty]
connect_bd_net [get_bd_pins packer_udp2/rd_data_count] [get_bd_pins rd_data_count]
connect_bd_net [get_bd_pins packer_udp2/s_ready] [get_bd_pins fm_demod2/m_axis_tready_0]
connect_bd_net [get_bd_pins rd_en] [get_bd_pins packer_udp2/rd_en]

current_bd_instance /station1
connect_bd_net -net LTC_2208_0_m_axis_tdata [get_bd_pins adc_data] [get_bd_pins fm_demod2/adc_data]
connect_bd_net -net LTC_2208_0_m_axis_tvalid [get_bd_pins m_axis_tready] [get_bd_pins fm_demod2/m_axis_tready]
connect_bd_net -net adc_dci_0_1 [get_bd_pins wr_clk] [get_bd_pins packer_udp2/wr_clk] [get_bd_pins fm_demod2/adc_clk]
connect_bd_net -net clk_wiz_0_locked [get_bd_pins rst_n] [get_bd_pins packer_udp2/rst_n]
connect_bd_net -net en_0_1 [get_bd_pins locked] [get_bd_pins fm_demod2/locked]
connect_bd_net [get_bd_pins fm_demod2/m_axis_tdata] [get_bd_pins packer_udp2/s_data]
connect_bd_net [get_bd_pins fm_demod2/m_axis_tvalid] [get_bd_pins packer_udp2/s_valid]
connect_bd_net -net packer_for_udp_Res1 [get_bd_pins rst] [get_bd_pins packer_udp2/rst]
connect_bd_net -net packer_for_udp_gmii_rxc [get_bd_pins rd_clk] [get_bd_pins packer_udp2/rd_clk]
connect_bd_net [get_bd_pins packer_udp2/dout] [get_bd_pins dout]
connect_bd_net [get_bd_pins packer_udp2/empty] [get_bd_pins empty]
connect_bd_net [get_bd_pins packer_udp2/rd_data_count] [get_bd_pins rd_data_count]
connect_bd_net [get_bd_pins packer_udp2/s_ready] [get_bd_pins fm_demod2/m_axis_tready_0]
connect_bd_net [get_bd_pins rd_en] [get_bd_pins packer_udp2/rd_en]

current_bd_instance /station2
connect_bd_net -net LTC_2208_0_m_axis_tdata [get_bd_pins adc_data] [get_bd_pins fm_demod2/adc_data]
connect_bd_net -net LTC_2208_0_m_axis_tvalid [get_bd_pins m_axis_tready] [get_bd_pins fm_demod2/m_axis_tready]
connect_bd_net -net adc_dci_0_1 [get_bd_pins wr_clk] [get_bd_pins packer_udp2/wr_clk] [get_bd_pins fm_demod2/adc_clk]
connect_bd_net -net clk_wiz_0_locked [get_bd_pins rst_n] [get_bd_pins packer_udp2/rst_n]
connect_bd_net -net en_0_1 [get_bd_pins locked] [get_bd_pins fm_demod2/locked]
connect_bd_net [get_bd_pins fm_demod2/m_axis_tdata] [get_bd_pins packer_udp2/s_data]
connect_bd_net [get_bd_pins fm_demod2/m_axis_tvalid] [get_bd_pins packer_udp2/s_valid]
connect_bd_net -net packer_for_udp_Res1 [get_bd_pins rst] [get_bd_pins packer_udp2/rst]
connect_bd_net -net packer_for_udp_gmii_rxc [get_bd_pins rd_clk] [get_bd_pins packer_udp2/rd_clk]
connect_bd_net [get_bd_pins packer_udp2/dout] [get_bd_pins dout]
connect_bd_net [get_bd_pins packer_udp2/empty] [get_bd_pins empty]
connect_bd_net [get_bd_pins packer_udp2/rd_data_count] [get_bd_pins rd_data_count]
connect_bd_net [get_bd_pins packer_udp2/s_ready] [get_bd_pins fm_demod2/m_axis_tready_0]
connect_bd_net [get_bd_pins rd_en] [get_bd_pins packer_udp2/rd_en]

current_bd_instance /station3
connect_bd_net -net LTC_2208_0_m_axis_tdata [get_bd_pins adc_data] [get_bd_pins fm_demod2/adc_data]
connect_bd_net -net LTC_2208_0_m_axis_tvalid [get_bd_pins m_axis_tready] [get_bd_pins fm_demod2/m_axis_tready]
connect_bd_net -net adc_dci_0_1 [get_bd_pins wr_clk] [get_bd_pins packer_udp2/wr_clk] [get_bd_pins fm_demod2/adc_clk]
connect_bd_net -net clk_wiz_0_locked [get_bd_pins rst_n] [get_bd_pins packer_udp2/rst_n]
connect_bd_net -net en_0_1 [get_bd_pins locked] [get_bd_pins fm_demod2/locked]
connect_bd_net [get_bd_pins fm_demod2/m_axis_tdata] [get_bd_pins packer_udp2/s_data]
connect_bd_net [get_bd_pins fm_demod2/m_axis_tvalid] [get_bd_pins packer_udp2/s_valid]
connect_bd_net -net packer_for_udp_Res1 [get_bd_pins rst] [get_bd_pins packer_udp2/rst]
connect_bd_net -net packer_for_udp_gmii_rxc [get_bd_pins rd_clk] [get_bd_pins packer_udp2/rd_clk]
connect_bd_net [get_bd_pins packer_udp2/dout] [get_bd_pins dout]
connect_bd_net [get_bd_pins packer_udp2/empty] [get_bd_pins empty]
connect_bd_net [get_bd_pins packer_udp2/rd_data_count] [get_bd_pins rd_data_count]
connect_bd_net [get_bd_pins packer_udp2/s_ready] [get_bd_pins fm_demod2/m_axis_tready_0]
connect_bd_net [get_bd_pins rd_en] [get_bd_pins packer_udp2/rd_en]

current_bd_instance /station4
connect_bd_net -net LTC_2208_0_m_axis_tdata [get_bd_pins adc_data] [get_bd_pins fm_demod2/adc_data]
connect_bd_net -net LTC_2208_0_m_axis_tvalid [get_bd_pins m_axis_tready] [get_bd_pins fm_demod2/m_axis_tready]
connect_bd_net -net adc_dci_0_1 [get_bd_pins wr_clk] [get_bd_pins packer_udp2/wr_clk] [get_bd_pins fm_demod2/adc_clk]
connect_bd_net -net clk_wiz_0_locked [get_bd_pins rst_n] [get_bd_pins packer_udp2/rst_n]
connect_bd_net -net en_0_1 [get_bd_pins locked] [get_bd_pins fm_demod2/locked]
connect_bd_net [get_bd_pins fm_demod2/m_axis_tdata] [get_bd_pins packer_udp2/s_data]
connect_bd_net [get_bd_pins fm_demod2/m_axis_tvalid] [get_bd_pins packer_udp2/s_valid]
connect_bd_net -net packer_for_udp_Res1 [get_bd_pins rst] [get_bd_pins packer_udp2/rst]
connect_bd_net -net packer_for_udp_gmii_rxc [get_bd_pins rd_clk] [get_bd_pins packer_udp2/rd_clk]
connect_bd_net [get_bd_pins packer_udp2/dout] [get_bd_pins dout]
connect_bd_net [get_bd_pins packer_udp2/empty] [get_bd_pins empty]
connect_bd_net [get_bd_pins packer_udp2/rd_data_count] [get_bd_pins rd_data_count]
connect_bd_net [get_bd_pins packer_udp2/s_ready] [get_bd_pins fm_demod2/m_axis_tready_0]
connect_bd_net [get_bd_pins rd_en] [get_bd_pins packer_udp2/rd_en]

current_bd_instance /station5
connect_bd_net -net LTC_2208_0_m_axis_tdata [get_bd_pins adc_data] [get_bd_pins fm_demod2/adc_data]
connect_bd_net -net LTC_2208_0_m_axis_tvalid [get_bd_pins m_axis_tready] [get_bd_pins fm_demod2/m_axis_tready]
connect_bd_net -net adc_dci_0_1 [get_bd_pins wr_clk] [get_bd_pins packer_udp2/wr_clk] [get_bd_pins fm_demod2/adc_clk]
connect_bd_net -net clk_wiz_0_locked [get_bd_pins rst_n] [get_bd_pins packer_udp2/rst_n]
connect_bd_net -net en_0_1 [get_bd_pins locked] [get_bd_pins fm_demod2/locked]
connect_bd_net [get_bd_pins fm_demod2/m_axis_tdata] [get_bd_pins packer_udp2/s_data]
connect_bd_net [get_bd_pins fm_demod2/m_axis_tvalid] [get_bd_pins packer_udp2/s_valid]
connect_bd_net -net packer_for_udp_Res1 [get_bd_pins rst] [get_bd_pins packer_udp2/rst]
connect_bd_net -net packer_for_udp_gmii_rxc [get_bd_pins rd_clk] [get_bd_pins packer_udp2/rd_clk]
connect_bd_net [get_bd_pins packer_udp2/dout] [get_bd_pins dout]
connect_bd_net [get_bd_pins packer_udp2/empty] [get_bd_pins empty]
connect_bd_net [get_bd_pins packer_udp2/rd_data_count] [get_bd_pins rd_data_count]
connect_bd_net [get_bd_pins packer_udp2/s_ready] [get_bd_pins fm_demod2/m_axis_tready_0]
connect_bd_net [get_bd_pins rd_en] [get_bd_pins packer_udp2/rd_en]

current_bd_instance /station6
connect_bd_net -net LTC_2208_0_m_axis_tdata [get_bd_pins adc_data] [get_bd_pins fm_demod2/adc_data]
connect_bd_net -net LTC_2208_0_m_axis_tvalid [get_bd_pins m_axis_tready] [get_bd_pins fm_demod2/m_axis_tready]
connect_bd_net -net adc_dci_0_1 [get_bd_pins wr_clk] [get_bd_pins packer_udp2/wr_clk] [get_bd_pins fm_demod2/adc_clk]
connect_bd_net -net clk_wiz_0_locked [get_bd_pins rst_n] [get_bd_pins packer_udp2/rst_n]
connect_bd_net -net en_0_1 [get_bd_pins locked] [get_bd_pins fm_demod2/locked]
connect_bd_net [get_bd_pins fm_demod2/m_axis_tdata] [get_bd_pins packer_udp2/s_data]
connect_bd_net [get_bd_pins fm_demod2/m_axis_tvalid] [get_bd_pins packer_udp2/s_valid]
connect_bd_net -net packer_for_udp_Res1 [get_bd_pins rst] [get_bd_pins packer_udp2/rst]
connect_bd_net -net packer_for_udp_gmii_rxc [get_bd_pins rd_clk] [get_bd_pins packer_udp2/rd_clk]
connect_bd_net [get_bd_pins packer_udp2/dout] [get_bd_pins dout]
connect_bd_net [get_bd_pins packer_udp2/empty] [get_bd_pins empty]
connect_bd_net [get_bd_pins packer_udp2/rd_data_count] [get_bd_pins rd_data_count]
connect_bd_net [get_bd_pins packer_udp2/s_ready] [get_bd_pins fm_demod2/m_axis_tready_0]
connect_bd_net [get_bd_pins rd_en] [get_bd_pins packer_udp2/rd_en]

current_bd_instance /station7
connect_bd_net -net LTC_2208_0_m_axis_tdata [get_bd_pins adc_data] [get_bd_pins fm_demod2/adc_data]
connect_bd_net -net LTC_2208_0_m_axis_tvalid [get_bd_pins m_axis_tready] [get_bd_pins fm_demod2/m_axis_tready]
connect_bd_net -net adc_dci_0_1 [get_bd_pins wr_clk] [get_bd_pins packer_udp2/wr_clk] [get_bd_pins fm_demod2/adc_clk]
connect_bd_net -net clk_wiz_0_locked [get_bd_pins rst_n] [get_bd_pins packer_udp2/rst_n]
connect_bd_net -net en_0_1 [get_bd_pins locked] [get_bd_pins fm_demod2/locked]
connect_bd_net [get_bd_pins fm_demod2/m_axis_tdata] [get_bd_pins packer_udp2/s_data]
connect_bd_net [get_bd_pins fm_demod2/m_axis_tvalid] [get_bd_pins packer_udp2/s_valid]
connect_bd_net -net packer_for_udp_Res1 [get_bd_pins rst] [get_bd_pins packer_udp2/rst]
connect_bd_net -net packer_for_udp_gmii_rxc [get_bd_pins rd_clk] [get_bd_pins packer_udp2/rd_clk]
connect_bd_net [get_bd_pins packer_udp2/dout] [get_bd_pins dout]
connect_bd_net [get_bd_pins packer_udp2/empty] [get_bd_pins empty]
connect_bd_net [get_bd_pins packer_udp2/rd_data_count] [get_bd_pins rd_data_count]
connect_bd_net [get_bd_pins packer_udp2/s_ready] [get_bd_pins fm_demod2/m_axis_tready_0]
connect_bd_net [get_bd_pins rd_en] [get_bd_pins packer_udp2/rd_en]

current_bd_instance /station8
connect_bd_net -net LTC_2208_0_m_axis_tdata [get_bd_pins adc_data] [get_bd_pins fm_demod2/adc_data]
connect_bd_net -net LTC_2208_0_m_axis_tvalid [get_bd_pins m_axis_tready] [get_bd_pins fm_demod2/m_axis_tready]
connect_bd_net -net adc_dci_0_1 [get_bd_pins wr_clk] [get_bd_pins packer_udp2/wr_clk] [get_bd_pins fm_demod2/adc_clk]
connect_bd_net -net clk_wiz_0_locked [get_bd_pins rst_n] [get_bd_pins packer_udp2/rst_n]
connect_bd_net -net en_0_1 [get_bd_pins locked] [get_bd_pins fm_demod2/locked]
connect_bd_net [get_bd_pins fm_demod2/m_axis_tdata] [get_bd_pins packer_udp2/s_data]
connect_bd_net [get_bd_pins fm_demod2/m_axis_tvalid] [get_bd_pins packer_udp2/s_valid]
connect_bd_net -net packer_for_udp_Res1 [get_bd_pins rst] [get_bd_pins packer_udp2/rst]
connect_bd_net -net packer_for_udp_gmii_rxc [get_bd_pins rd_clk] [get_bd_pins packer_udp2/rd_clk]
connect_bd_net [get_bd_pins packer_udp2/dout] [get_bd_pins dout]
connect_bd_net [get_bd_pins packer_udp2/empty] [get_bd_pins empty]
connect_bd_net [get_bd_pins packer_udp2/rd_data_count] [get_bd_pins rd_data_count]
connect_bd_net [get_bd_pins packer_udp2/s_ready] [get_bd_pins fm_demod2/m_axis_tready_0]
connect_bd_net [get_bd_pins rd_en] [get_bd_pins packer_udp2/rd_en]

current_bd_instance /station9
connect_bd_net -net LTC_2208_0_m_axis_tdata [get_bd_pins adc_data] [get_bd_pins fm_demod2/adc_data]
connect_bd_net -net LTC_2208_0_m_axis_tvalid [get_bd_pins m_axis_tready] [get_bd_pins fm_demod2/m_axis_tready]
connect_bd_net -net adc_dci_0_1 [get_bd_pins wr_clk] [get_bd_pins packer_udp2/wr_clk] [get_bd_pins fm_demod2/adc_clk]
connect_bd_net -net clk_wiz_0_locked [get_bd_pins rst_n] [get_bd_pins packer_udp2/rst_n]
connect_bd_net -net en_0_1 [get_bd_pins locked] [get_bd_pins fm_demod2/locked]
connect_bd_net [get_bd_pins fm_demod2/m_axis_tdata] [get_bd_pins packer_udp2/s_data]
connect_bd_net [get_bd_pins fm_demod2/m_axis_tvalid] [get_bd_pins packer_udp2/s_valid]
connect_bd_net -net packer_for_udp_Res1 [get_bd_pins rst] [get_bd_pins packer_udp2/rst]
connect_bd_net -net packer_for_udp_gmii_rxc [get_bd_pins rd_clk] [get_bd_pins packer_udp2/rd_clk]
connect_bd_net [get_bd_pins packer_udp2/dout] [get_bd_pins dout]
connect_bd_net [get_bd_pins packer_udp2/empty] [get_bd_pins empty]
connect_bd_net [get_bd_pins packer_udp2/rd_data_count] [get_bd_pins rd_data_count]
connect_bd_net [get_bd_pins packer_udp2/s_ready] [get_bd_pins fm_demod2/m_axis_tready_0]
connect_bd_net [get_bd_pins rd_en] [get_bd_pins packer_udp2/rd_en]

current_bd_instance /
connect_bd_net [get_bd_pins LTC_2208_0/m_axis_tdata] \
  [get_bd_pins station0/adc_data] [get_bd_pins station9/adc_data] [get_bd_pins station8/adc_data] \
  [get_bd_pins station7/adc_data] [get_bd_pins station6/adc_data] [get_bd_pins station5/adc_data] \
  [get_bd_pins station4/adc_data] [get_bd_pins station3/adc_data] [get_bd_pins station2/adc_data] \
  [get_bd_pins station1/adc_data]
connect_bd_net [get_bd_pins LTC_2208_0/m_axis_tvalid] \
  [get_bd_pins station0/m_axis_tready] [get_bd_pins station1/m_axis_tready] [get_bd_pins station2/m_axis_tready] \
  [get_bd_pins station3/m_axis_tready] [get_bd_pins station4/m_axis_tready] [get_bd_pins station5/m_axis_tready] \
  [get_bd_pins station6/m_axis_tready] [get_bd_pins station7/m_axis_tready] [get_bd_pins station8/m_axis_tready] \
  [get_bd_pins station9/m_axis_tready]
connect_bd_net [get_bd_ports mdio] [get_bd_pins packer_for_udp/mdio]
connect_bd_net [get_bd_ports adc_dai] [get_bd_pins LTC_2208_0/adc_dai]
connect_bd_net -net adc_dci_0_1 [get_bd_pins clk_wiz_1/clk_adcR] \
  [get_bd_pins LTC_2208_0/adc_dci] [get_bd_pins station0/wr_clk] [get_bd_pins station1/wr_clk] [get_bd_pins station2/wr_clk] \
  [get_bd_pins station3/wr_clk] [get_bd_pins station4/wr_clk] [get_bd_pins station5/wr_clk] [get_bd_pins station6/wr_clk] \
  [get_bd_pins station7/wr_clk] [get_bd_pins station8/wr_clk] [get_bd_pins station9/wr_clk]
connect_bd_net -net audio_dout_bus_1 [get_bd_pins stations_to_packet_0/audio_dout_bus] [get_bd_pins packer_for_udp/audio_dout_bus]
connect_bd_net -net audio_empty_1 [get_bd_pins stations_to_packet_0/audio_empty] [get_bd_pins packer_for_udp/audio_empty]
connect_bd_net [get_bd_ports clk_50M] [get_bd_pins clk_wiz_0/clk_in1] [get_bd_pins packer_for_udp/mdio_clk50]
connect_bd_net [get_bd_pins clk_wiz_0/clk_out1] [get_bd_pins clk_wiz_1/clk_in1]
connect_bd_net [get_bd_pins clk_wiz_0/locked] \
  [get_bd_pins clk_wiz_1/resetn] [get_bd_pins packer_for_udp/arst_n] [get_bd_pins station0/rst_n] \
  [get_bd_pins station1/rst_n] [get_bd_pins station2/rst_n] [get_bd_pins station3/rst_n] [get_bd_pins station4/rst_n] \
  [get_bd_pins station5/rst_n] [get_bd_pins station6/rst_n] [get_bd_pins station7/rst_n] [get_bd_pins station8/rst_n] \
  [get_bd_pins station9/rst_n]
connect_bd_net [get_bd_pins clk_wiz_1/clk_adc] [get_bd_ports adc_clk]
connect_bd_net [get_bd_pins clk_wiz_1/clkfb_out] [get_bd_pins clk_wiz_1/clkfb_in]
connect_bd_net -net en_0_1 [get_bd_ports locked] \
  [get_bd_pins clk_wiz_0/resetn] [get_bd_pins station0/locked] [get_bd_pins station1/locked] [get_bd_pins station2/locked] \
  [get_bd_pins station3/locked] [get_bd_pins station4/locked] [get_bd_pins station5/locked] [get_bd_pins station6/locked] \
  [get_bd_pins station7/locked] [get_bd_pins station8/locked] [get_bd_pins station9/locked]
connect_bd_net -net packer_for_udp_Res1 [get_bd_pins packer_for_udp/Reset] \
  [get_bd_pins station0/rst] [get_bd_pins station9/rst] [get_bd_pins station8/rst] [get_bd_pins station7/rst] \
  [get_bd_pins station6/rst] [get_bd_pins station5/rst] [get_bd_pins station4/rst] [get_bd_pins station3/rst] \
  [get_bd_pins station2/rst] [get_bd_pins station1/rst]
connect_bd_net [get_bd_pins packer_for_udp/audio_rd_en] [get_bd_pins stations_to_packet_0/audio_rd_en]
connect_bd_net [get_bd_pins packer_for_udp/gmii_rxc] \
  [get_bd_pins station0/rd_clk] [get_bd_pins station1/rd_clk] [get_bd_pins station2/rd_clk] [get_bd_pins station3/rd_clk] \
  [get_bd_pins station4/rd_clk] [get_bd_pins station5/rd_clk] [get_bd_pins station6/rd_clk] [get_bd_pins station7/rd_clk] \
  [get_bd_pins station8/rd_clk] [get_bd_pins station9/rd_clk]
connect_bd_net [get_bd_pins packer_for_udp/linkspeed] [get_bd_ports linkspeed]
connect_bd_net [get_bd_pins packer_for_udp/mdc] [get_bd_ports mdc]
connect_bd_net [get_bd_pins packer_for_udp/phy_rstn] [get_bd_ports phy_rstn]
connect_bd_net [get_bd_pins packer_for_udp/phy_tx_ctrl] [get_bd_ports phy_tx_ctrl]
connect_bd_net [get_bd_pins packer_for_udp/phy_txc] [get_bd_ports phy_txc]
connect_bd_net [get_bd_pins packer_for_udp/phy_txd] [get_bd_ports phy_txd]
connect_bd_net -net phy_rx_ctrl_0_1 [get_bd_ports phy_rx_ctrl] [get_bd_pins packer_for_udp/phy_rx_ctrl]
connect_bd_net -net phy_rxc_0_1 [get_bd_ports phy_rxc] [get_bd_pins packer_for_udp/phy_rxc]
connect_bd_net -net phy_rxd_0_1 [get_bd_ports phy_rxd] [get_bd_pins packer_for_udp/phy_rxd]
connect_bd_net -net rd_en_1 [get_bd_pins stations_to_packet_0/st0_rd_en] [get_bd_pins station0/rd_en]
connect_bd_net [get_bd_pins station0/dout] [get_bd_pins stations_to_packet_0/st0_dout]
connect_bd_net [get_bd_pins station0/empty] [get_bd_pins stations_to_packet_0/st0_empty]
connect_bd_net [get_bd_pins station0/rd_data_count] [get_bd_pins stations_to_packet_0/st0_rd_data_count]
connect_bd_net [get_bd_pins station1/dout] [get_bd_pins stations_to_packet_0/st1_dout]
connect_bd_net [get_bd_pins station1/empty] [get_bd_pins stations_to_packet_0/st1_empty]
connect_bd_net [get_bd_pins station1/rd_data_count] [get_bd_pins stations_to_packet_0/st1_rd_data_count]
connect_bd_net [get_bd_pins station2/dout] [get_bd_pins stations_to_packet_0/st2_dout]
connect_bd_net [get_bd_pins station2/empty] [get_bd_pins stations_to_packet_0/st2_empty]
connect_bd_net [get_bd_pins station2/rd_data_count] [get_bd_pins stations_to_packet_0/st2_rd_data_count]
connect_bd_net [get_bd_pins station3/dout] [get_bd_pins stations_to_packet_0/st3_dout]
connect_bd_net [get_bd_pins station3/empty] [get_bd_pins stations_to_packet_0/st3_empty]
connect_bd_net [get_bd_pins station3/rd_data_count] [get_bd_pins stations_to_packet_0/st3_rd_data_count]
connect_bd_net [get_bd_pins station4/dout] [get_bd_pins stations_to_packet_0/st4_dout]
connect_bd_net [get_bd_pins station4/empty] [get_bd_pins stations_to_packet_0/st4_empty]
connect_bd_net [get_bd_pins station4/rd_data_count] [get_bd_pins stations_to_packet_0/st4_rd_data_count]
connect_bd_net [get_bd_pins station5/dout] [get_bd_pins stations_to_packet_0/st5_dout]
connect_bd_net [get_bd_pins station5/empty] [get_bd_pins stations_to_packet_0/st5_empty]
connect_bd_net [get_bd_pins station5/rd_data_count] [get_bd_pins stations_to_packet_0/st5_rd_data_count]
connect_bd_net [get_bd_pins station6/dout] [get_bd_pins stations_to_packet_0/st6_dout]
connect_bd_net [get_bd_pins station6/empty] [get_bd_pins stations_to_packet_0/st6_empty]
connect_bd_net [get_bd_pins station6/rd_data_count] [get_bd_pins stations_to_packet_0/st6_rd_data_count]
connect_bd_net [get_bd_pins station7/dout] [get_bd_pins stations_to_packet_0/st7_dout]
connect_bd_net [get_bd_pins station7/empty] [get_bd_pins stations_to_packet_0/st7_empty]
connect_bd_net [get_bd_pins station7/rd_data_count] [get_bd_pins stations_to_packet_0/st7_rd_data_count]
connect_bd_net [get_bd_pins station8/dout] [get_bd_pins stations_to_packet_0/st8_dout]
connect_bd_net [get_bd_pins station8/empty] [get_bd_pins stations_to_packet_0/st8_empty]
connect_bd_net [get_bd_pins station8/rd_data_count] [get_bd_pins stations_to_packet_0/st8_rd_data_count]
connect_bd_net [get_bd_pins station9/dout] [get_bd_pins stations_to_packet_0/st9_dout]
connect_bd_net [get_bd_pins station9/empty] [get_bd_pins stations_to_packet_0/st9_empty]
connect_bd_net [get_bd_pins station9/rd_data_count] [get_bd_pins stations_to_packet_0/st9_rd_data_count]
connect_bd_net [get_bd_pins stations_to_packet_0/audio_rd_count_bus] [get_bd_pins packer_for_udp/audio_rd_count_bus]
connect_bd_net [get_bd_pins stations_to_packet_0/st1_rd_en] [get_bd_pins station1/rd_en]
connect_bd_net [get_bd_pins stations_to_packet_0/st2_rd_en] [get_bd_pins station2/rd_en]
connect_bd_net [get_bd_pins stations_to_packet_0/st3_rd_en] [get_bd_pins station3/rd_en]
connect_bd_net [get_bd_pins stations_to_packet_0/st4_rd_en] [get_bd_pins station4/rd_en]
connect_bd_net [get_bd_pins stations_to_packet_0/st5_rd_en] [get_bd_pins station5/rd_en]
connect_bd_net [get_bd_pins stations_to_packet_0/st6_rd_en] [get_bd_pins station6/rd_en]
connect_bd_net [get_bd_pins stations_to_packet_0/st7_rd_en] [get_bd_pins station7/rd_en]
connect_bd_net [get_bd_pins stations_to_packet_0/st8_rd_en] [get_bd_pins station8/rd_en]
connect_bd_net [get_bd_pins stations_to_packet_0/st9_rd_en] [get_bd_pins station9/rd_en]
connect_bd_net [get_bd_ports sys] [get_bd_pins packer_for_udp/iodelay_ref_clk200]
connect_bd_net [get_bd_ports sys_rst_n] [get_bd_pins LTC_2208_0/sys_rst_n]

validate_bd_design
save_bd_design
